# Altium project ATM90E3x-DB.PrjPcb
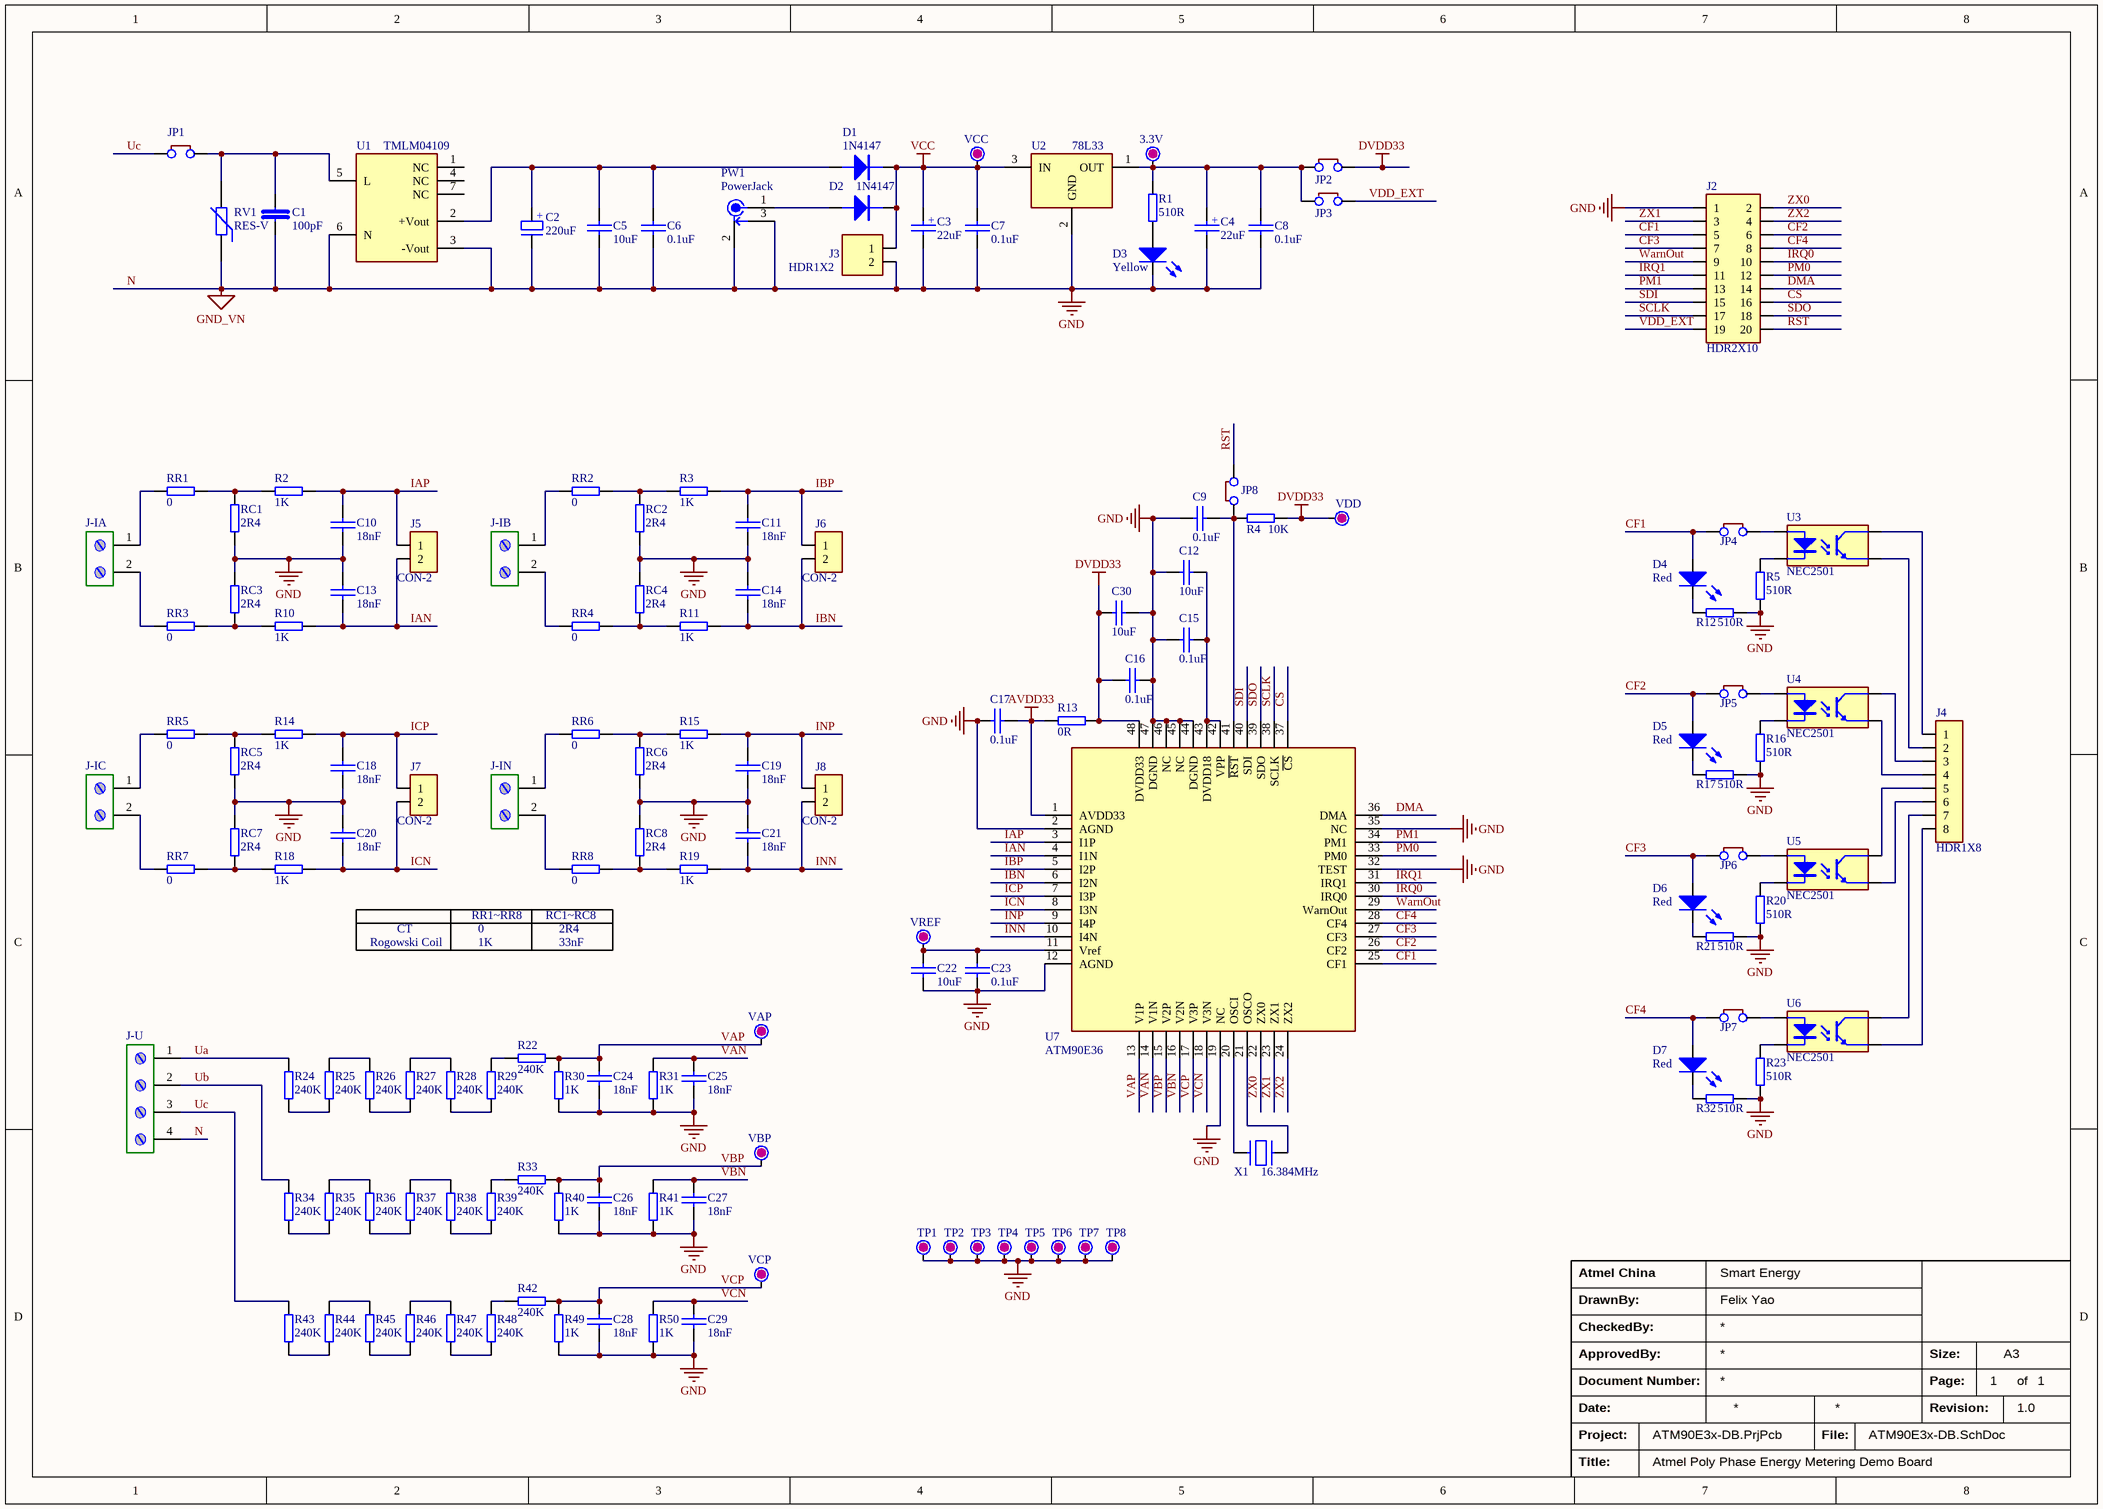
[diagram p0: ATM90E3x-DB.SchDoc]
1 sheet, 144 parts. Net scope: global (net labels, ports and power ports of the same name join across sheets).
Board file: ATM90E3x-DB.PcbDoc

## Sheet ATM90E3x-DB.SchDoc: Atmel Poly Phase Energy Metering Demo Board
size A3; DrawnBy: Felix Yao; Organization: Smart Energy; Revision: 1.0; SheetNumber: 1; SheetTotal: 1; PageSetup: Record=PageOptions|CenterHorizontal=True|CenterVertical=True|PrintScale=0.71|XCorrection=1.00|YCorrection=1.00|PrintKind=1|BorderSize=5000000|LeftOffset=0|BottomOffset=0|Orientation=2|PaperLength=2969|PaperWidth=2100|Scale=100|PaperSource=7|PrintQuality=600|MediaType=1|DitherType=10|PaperKind=A4 (210 x 297 mm)|PrintScaleMode=1

### Parts
3.3V  (no value)  [TP]
C1  100pF  [C_FILM_600]
C2  220uF  [C_ALUM_MIX_10x10]
C3  22uF  [C_TANT_B3528]
C4  22uF  [C_TANT_B3528]
C5  10uF  [C0805]
C6  0.1uF  [C0805]
C7  0.1uF  [C0805]
C8  0.1uF  [C0805]
C9  0.1uF  [C0603]
C10  18nF  [C0805]
C11  18nF  [C0805]
C12  10uF  [C0805]
C13  18nF  [C0805]
C14  18nF  [C0805]
C15  0.1uF  [C0603]
C16  0.1uF  [C0603]
C17  0.1uF  [C0603]
C18  18nF  [C0805]
C19  18nF  [C0805]
C20  18nF  [C0805]
C21  18nF  [C0805]
C22  10uF  [C0805]
C23  0.1uF  [C0603]
C24  18nF  [C0805]
C25  18nF  [C0805]
C26  18nF  [C0805]
C27  18nF  [C0805]
C28  18nF  [C0805]
C29  18nF  [C0805]
C30  10uF  [C0805]
D1  1N4147  [SMA DO-214AC]
D2  1N4147  [SMA DO-214AC]
D3  Yellow  [LED-0805Y]
D4  Red  [LED-0805R]
D5  Red  [LED-0805R]
D6  Red  [LED-0805R]
D7  Red  [LED-0805R]
J2  HDR2X10  [HDR2X10]
J3  HDR1X2  [HDR1X2]
J4  HDR1X8  [HDR1X8]
J5  CON-2  [HDR1X2(uper)]
J6  CON-2  [HDR1X2(uper)]
J7  CON-2  [HDR1X2(uper)]
J8  CON-2  [HDR1X2(uper)]
J-IA  (no value)  [TE-1776119-2]
J-IB  (no value)  [TE-1776119-2]
J-IC  (no value)  [TE-1776119-2]
J-IN  (no value)  [TE-1776119-2]
J-U  (no value)  [TE-282843-4]
JP1  JMP  [JMP-SMD]  (value not drawn)
JP2  JMP  [JMP]  (value not drawn)
JP3  JMP  [JMP]  (value not drawn)
JP4  JMP  [JMP]  (value not drawn)
JP5  JMP  [JMP]  (value not drawn)
JP6  JMP  [JMP]  (value not drawn)
JP7  JMP  [JMP]  (value not drawn)
JP8  JMP  [JMP]  (value not drawn)
PW1  PowerJack  [PowerJacket2.5]
R1  510R  [R0805]
R2  1K  [R0805]
R3  1K  [R0805]
R4  10K  [R0603]
R5  510R  [R0805]
R10  1K  [R0805]
R11  1K  [R0805]
R12  510R  [R0805]
R13  0R  [R0603]
R14  1K  [R0805]
R15  1K  [R0805]
R16  510R  [R0805]
R17  510R  [R0805]
R18  1K  [R0805]
R19  1K  [R0805]
R20  510R  [R0805]
R21  510R  [R0805]
R22  240K  [R1206]
R23  510R  [R0805]
R24  240K  [R1206]
R25  240K  [R1206]
R26  240K  [R1206]
R27  240K  [R1206]
R28  240K  [R1206]
R29  240K  [R1206]
R30  1K  [R0805]
R31  1K  [R0805]
R32  510R  [R0805]
R33  240K  [R1206]
R34  240K  [R1206]
R35  240K  [R1206]
R36  240K  [R1206]
R37  240K  [R1206]
R38  240K  [R1206]
R39  240K  [R1206]
R40  1K  [R0805]
R41  1K  [R0805]
R42  240K  [R1206]
R43  240K  [R1206]
R44  240K  [R1206]
R45  240K  [R1206]
R46  240K  [R1206]
R47  240K  [R1206]
R48  240K  [R1206]
R49  1K  [R0805]
R50  1K  [R0805]
RC1  2R4  [R0805]
RC2  2R4  [R0805]
RC3  2R4  [R0805]
RC4  2R4  [R0805]
RC5  2R4  [R0805]
RC6  2R4  [R0805]
RC7  2R4  [R0805]
RC8  2R4  [R0805]
RR1  0  [R0805]
RR2  0  [R0805]
RR3  0  [R0805]
RR4  0  [R0805]
RR5  0  [R0805]
RR6  0  [R0805]
RR7  0  [R0805]
RR8  0  [R0805]
RV1  RES-V  [VDRS10P510BSE]
TP1  GND  [TP]  (value not drawn)
TP2  GND  [TP]  (value not drawn)
TP3  GND  [TP]  (value not drawn)
TP4  GND  [TP]  (value not drawn)
TP5  GND  [TP-SMD]  (value not drawn)
TP6  GND  [TP-SMD]  (value not drawn)
TP7  GND  [TP-SMD]  (value not drawn)
TP8  GND  [TP-SMD]  (value not drawn)
U1  TMLM04109  [TMLM04112]
U2  78L33  [SOT-89]
U3  NEC2501  [PS2501L-1]
U4  NEC2501  [PS2501L-1]
U5  NEC2501  [PS2501L-1]
U6  NEC2501  [PS2501L-1]
U7  ATM90E36  [TQFP-48(7x7)]
VAP  (no value)  [TP]
VBP  (no value)  [TP]
VCC  (no value)  [TP]
VCP  (no value)  [TP]
VDD  (no value)  [TP]
VREF  (no value)  [TP]
X1  16.384MHz  [XTAL-MIX-49]

### Nets
AVDD33: C17.2 R13.2 U7.1(AVDD33)
DVDD33: C16.1 C30.2 JP2.2 R4.2 R13.1 U7.48(DVDD33) VDD.1
N: C1.1 C2.2 C3.2 C4.2 C5.1 C6.1 C7.1 C8.1 C9.1 C10.1 C11.2 C12.2 C13.2 C14.1 C15.1 C16.2 C17.1 C18.2 C19.2 C20.1 C21.1 C22.1 C23.1 C24.1 C25.1 C26.1 C27.1 C28.1 C29.1 C30.1 D3.K J2.1 J3.2 J-U.4 PW1.2 PW1.3 R5.1 R12.1 R16.1 R17.1 R20.1 R21.1 R23.1 R30.1 R31.1 R32.1 R40.1 R41.1 R49.1 R50.1 RC1.1 RC2.1 RC3.2 RC4.2 RC5.1 RC6.1 RC7.2 RC8.2 RV1.1 TP1.1 TP2.1 TP3.1 TP4.1 TP5.1 TP6.1 TP7.1 TP8.1 U1.3(-Vout) U1.6(N) U2.2(GND) U7.2(AGND) U7.12(AGND) U7.19(NC) U7.32(TEST) U7.35(NC) U7.44(DGND) U7.45(NC) U7.46(NC) U7.47(DGND)  [also labelled GND, GND_VN]
VCC: C3.1 C7.2 D1.K D2.K J3.1 U2.3(IN) VCC.1
CF1: D4.A J2.5 JP4.1 U7.25(CF1)
CF2: D5.A J2.6 JP5.1 U7.26(CF2)
CF3: D6.A J2.7 JP6.1 U7.27(CF3)
CF4: D7.A J2.8 JP7.1 U7.28(CF4)
CS: J2.16 U7.37(~{CS})
DMA: J2.14 U7.36(DMA)
IAN: C13.1 J5.2 R10.1 U7.4(I1N)
IAP: C10.2 J5.1 R2.1 U7.3(I1P)
IBN: C14.2 J6.2 R11.2 U7.6(I2N)
IBP: C11.1 J6.1 R3.2 U7.5(I2P)
ICN: C20.2 J7.2 R18.2 U7.8(I3N)
ICP: C18.1 J7.1 R14.2 U7.7(I3P)
INN: C21.2 J8.2 R19.2 U7.10(I4N)
INP: C19.1 J8.1 R15.2 U7.9(I4P)
IRQ0: J2.10 U7.30(IRQ0)
IRQ1: J2.11 U7.31(IRQ1)
PM0: J2.12 U7.33(PM0)
PM1: J2.13 U7.34(PM1)
RST: J2.20 JP8.2
SCLK: J2.17 U7.38(SCLK)
SDI: J2.15 U7.40(SDI)
SDO: J2.18 U7.39(SDO)
Ua: J-U.1 R24.1
Ub: J-U.2 R34.2
Uc: J-U.3 JP1.1 R43.2
VAN: C25.2 R31.2 U7.14(V1N)
VAP: C24.2 R22.2 R30.2 U7.13(V1P) VAP.1
VBN: C27.2 R41.2 U7.16(V2N)
VBP: C26.2 R33.1 R40.2 U7.15(V2P) VBP.1
VCN: C29.2 R50.2 U7.18(V3N)
VCP: C28.2 R42.1 R49.2 U7.17(V3P) VCP.1
VDD_EXT: J2.19 JP3.2
WarnOut: J2.9 U7.29(WarnOut)
ZX0: J2.2 U7.22(ZX0)
ZX1: J2.3 U7.23(ZX1)
ZX2: J2.4 U7.24(ZX2)
Net3.3V_1: 3.3V.1 C4.1 C8.2 JP2.1 JP3.1 R1.2 U2.1(OUT)
NetC1_2: C1.2 JP1.2 RV1.2 U1.5(L)
NetC2_1: C2.1 C5.2 C6.2 D1.A U1.2(+Vout)
NetC9_2: C9.2 JP8.1 R4.1 U7.41(~{RST})
NetC12_1: C12.1 C15.2 U7.42(VPP) U7.43(DVDD18)
NetC22_2: C22.2 C23.2 U7.11(Vref) VREF.1
NetD2_A: D2.A PW1.1
NetD3_A: D3.A R1.1
NetD4_K: D4.K R12.2
NetD5_K: D5.K R17.2
NetD6_K: D6.K R21.2
NetD7_K: D7.K R32.2
NetJ4_1: J4.1 U3.4(C)
NetJ4_2: J4.2 U3.3(E)
NetJ4_3: J4.3 U4.4(C)
NetJ4_4: J4.4 U4.3(E)
NetJ4_5: J4.5 U5.4(C)
NetJ4_6: J4.6 U5.3(E)
NetJ4_7: J4.7 U6.4(C)
NetJ4_8: J4.8 U6.3(E)
NetJ-IA_1: J-IA.1 RR1.2
NetJ-IA_2: J-IA.2 RR3.2
NetJ-IB_1: J-IB.1 RR2.2
NetJ-IB_2: J-IB.2 RR4.2
NetJ-IC_1: J-IC.1 RR5.2
NetJ-IC_2: J-IC.2 RR7.2
NetJ-IN_1: J-IN.1 RR6.2
NetJ-IN_2: J-IN.2 RR8.2
NetJP4_2: JP4.2 U3.1(A)
NetJP5_2: JP5.2 U4.1(A)
NetJP6_2: JP6.2 U5.1(A)
NetJP7_2: JP7.2 U6.1(A)
NetR2_2: R2.2 RC1.2 RR1.1
NetR3_1: R3.1 RC2.2 RR2.1
NetR5_2: R5.2 U3.2(K)
NetR10_2: R10.2 RC3.1 RR3.1
NetR11_1: R11.1 RC4.1 RR4.1
NetR14_1: R14.1 RC5.2 RR5.1
NetR15_1: R15.1 RC6.2 RR6.1
NetR16_2: R16.2 U4.2(K)
NetR18_1: R18.1 RC7.1 RR7.1
NetR19_1: R19.1 RC8.1 RR8.1
NetR20_2: R20.2 U5.2(K)
NetR22_1: R22.1 R29.1
NetR23_2: R23.2 U6.2(K)
NetR24_2: R24.2 R25.2
NetR25_1: R25.1 R26.1
NetR26_2: R26.2 R27.2
NetR27_1: R27.1 R28.1
NetR28_2: R28.2 R29.2
NetR33_2: R33.2 R39.2
NetR34_1: R34.1 R35.1
NetR35_2: R35.2 R36.2
NetR36_1: R36.1 R37.1
NetR37_2: R37.2 R38.2
NetR38_1: R38.1 R39.1
NetR42_2: R42.2 R48.2
NetR43_1: R43.1 R44.1
NetR44_2: R44.2 R45.2
NetR45_1: R45.1 R46.1
NetR46_2: R46.2 R47.2
NetR47_1: R47.1 R48.1
NetU7_20: U7.20(OSCI) X1.2
NetU7_21: U7.21(OSCO) X1.1

Not connected (* = marked no-connect by the designer): U1 1(NC) 4(NC) 7(NC)

### Notes on the sheet
- RR1~RR8
- (near RR8) RC1~RC8
- Rogowski Coil
- CT
- 0
- 1K
- 2R4
- 33nF
- Atmel China
- DrawnBy:
- Document Number:
- CheckedBy:
- ApprovedBy:
- Page:
- Size:
- A3
- of
- Project:
- Date:
- File:
- Revision:
- Title:
- (in symbol CAP-ALUM) +
- (in symbol CAP-TANT) +

### Library data of the parts
3.3V TP1-TP8 VAP VBP VCC VCP VDD VREF = TEST-POINT
C1 = CAP-FILM
C2 = CAP-ALUM
C3 C4 = CAP-TANT
C5-C30 = CAP
D1 D2 = DIODE
D3-D7 = LED
J-IA J-IB J-IC J-IN = Terminal-Screw-2
J-U = Terminal-Screw-4
R1-R5 R10-R50 RC1-RC8 RR1-RR8 = RES
U1 = TMLM04112
U2 = 78LXX
U7 = ATM90E3X
X1 = XTAL-T